# EAGLE design NOT (EAGLE 9.6.2)
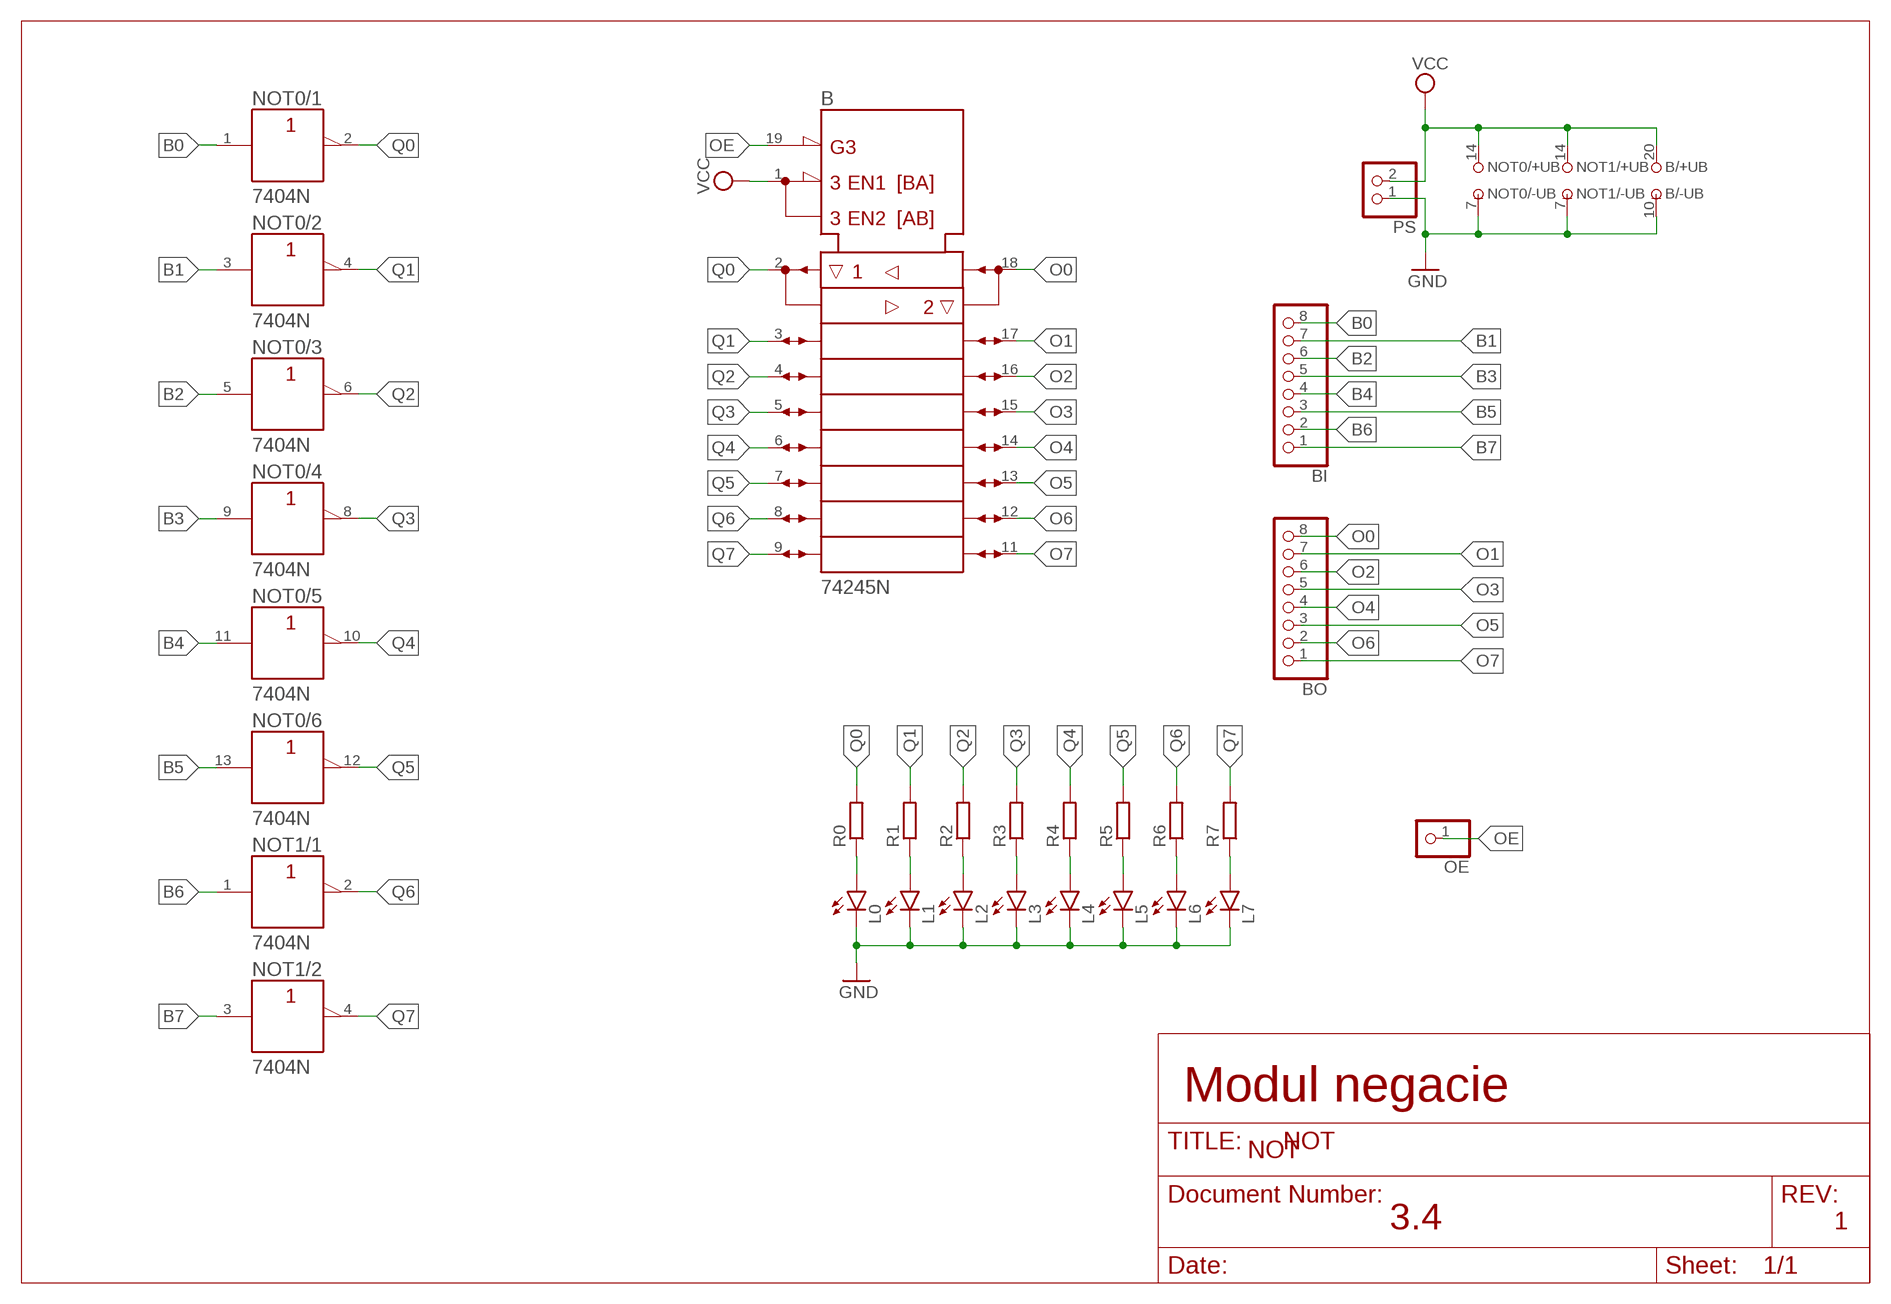
[diagram p0: schematic, sheet 1]

## Parts
B  74245N  [DIL20]
BI  PINHD-1X8  [1X08]
BO  PINHD-1X8  [1X08]
L0  LED5MM  [LED5MM]
L1  LED5MM  [LED5MM]
L2  LED5MM  [LED5MM]
L3  LED5MM  [LED5MM]
L4  LED5MM  [LED5MM]
L5  LED5MM  [LED5MM]
L6  LED5MM  [LED5MM]
L7  LED5MM  [LED5MM]
NOT0  7404N  [DIL14]
NOT1  7404N  [DIL14]
OE  PINHD-1X1  [1X01]
PS  PINHD-1X2  [1X02]
R0  R-EU_0204/7  [0204/7]
R1  R-EU_0204/7  [0204/7]
R2  R-EU_0204/7  [0204/7]
R3  R-EU_0204/7  [0204/7]
R4  R-EU_0204/7  [0204/7]
R5  R-EU_0204/7  [0204/7]
R6  R-EU_0204/7  [0204/7]
R7  R-EU_0204/7  [0204/7]

## Nets
B0: BI.8 NOT0.1(/1:A)
B1: BI.7 NOT0.3(/2:A)
B2: BI.6 NOT0.5(/3:A)
B3: BI.5 NOT0.9(/4:A)
B4: BI.4 NOT0.11(/5:A)
B5: BI.3 NOT0.13(/6:A)
B6: BI.2 NOT1.1(/1:A)
B7: BI.1 NOT1.3(/2:A)
GND: B.10(-UB) L0.K(C) L1.K(C) L2.K(C) L3.K(C) L4.K(C) L5.K(C) L6.K(C) L7.K(C) NOT0.7(/-UB:-UB) NOT1.7(/-UB:-UB) PS.1
N$33: L0.A R0.1
N$36: L1.A R1.1
N$39: L2.A R2.1
N$42: L3.A R3.1
N$45: L4.A R4.1
N$48: L5.A R5.1
N$51: L6.A R6.1
N$54: L7.A R7.1
O0: B.18(B1) BO.8
O1: B.17(B2) BO.7
O2: B.16(B3) BO.6
O3: B.15(B4) BO.5
O4: B.14(B5) BO.4
O5: B.13(B6) BO.3
O6: B.12(B7) BO.2
O7: B.11(B8) BO.1
OE: B.19(!G) OE.1
Q0: B.2(A1) NOT0.2(/1:Y) R0.2
Q1: B.3(A2) NOT0.4(/2:Y) R1.2
Q2: B.4(A3) NOT0.6(/3:Y) R2.2
Q3: B.5(A4) NOT0.8(/4:Y) R3.2
Q4: B.6(A5) NOT0.10(/5:Y) R4.2
Q5: B.7(A6) NOT0.12(/6:Y) R5.2
Q6: B.8(A7) NOT1.2(/1:Y) R6.2
Q7: B.9(A8) NOT1.4(/2:Y) R7.2
VCC: B.1(DIR) B.20(+UB) NOT0.14(/+UB:+UB) NOT1.14(/+UB:+UB) PS.2
Unconnected: NOT1.5(/3:A) NOT1.6(/3:Y) NOT1.8(/4:Y) NOT1.9(/4:A) NOT1.10(/5:Y) NOT1.11(/5:A) NOT1.12(/6:Y) NOT1.13(/6:A)

## Notes on the sheet
- Modul negacie
- NOT
- 3.4 | 1

## Library data of the parts
B = 74ttl-din:74*245: Octal BUS TRANSCEIVER, 3-state
BI BO = pinhead:PINHD-1X8: PIN HEADER
L0 L1-L7 = led:LED: LED OSRAM: - CHIPLED LG R971, LG N971, LY N971, LG Q971, LY Q971, LO R971, LY R971 LH N974, LH R974 LS Q976, LO Q976, LY Q976 LO Q996 - Hyper CHIPLED LW Q18S LB Q993, LB Q99A, LB R99A - SideLED LS A670, LO A670, LY A670, LG A670, LP A670 LB A673, LV A673, LT A673, LW A673 LH A674 LY A675 LS A676, LA A676, LO A676, LY A676, LW A676 LS A679, LY A679, LG A679 - Hyper Micro SIDELED® LS Y876, LA Y876, LO Y876, LY Y876 LT Y87S - SmartLED LW L88C, LW L88S LB L89C, LB L89S, LG L890 LS L89K, LO L89K, LY L89K LS L896, LA L896, LO L896, LY L896 - TOPLED LS T670, LO T670, LY T670, LG T670, LP T670 LSG T670, LSP T670, LSY T670, LOP T670, LYG T670 LG T671, LOG T671, LSG T671 LB T673, LV T673, LT T673, LW T673 LH T674 LS T676, LA T676, LO T676, LY T676, LB T676, LH T676, LSB T676, LW T676 LB T67C, LV T67C, LT T67C, LS T67K, LO T67K, LY T67K, LW E67C LS E67B, LA E67B, LO E67B, LY E67B, LB E67C, LV E67C, LT E67C LW T67C LS T679, LY T679, LG T679 LS T770, LO T770, LY T770, LG T770, LP T770 LB T773, LV T773, LT T773, LW T773 LH T774 LS E675, LA E675, LY E675, LS T675 LS T776, LA T776, LO T776, LY T776, LB T776 LHGB T686 LT T68C, LB T68C - Hyper Mini TOPLED® LB M676 - Mini TOPLED Santana® LG M470 LS M47K, LO M47K, LY M47K Source: http://www.osram.convergy.de LUXEON: - LUMILED® LXK2-PW12-R00, LXK2-PW12-S00, LXK2-PW14-U00, LXK2-PW14-V00 LXK2-PM12-R00, LXK2-PM12-S00, LXK2-PM14-U00 LXK2-PE12-Q00, LXK2-PE12-R00, LXK2-PE12-S00, LXK2-PE14-T00, LXK2-PE14-U00 LXK2-PB12-K00, LXK2-PB12-L00, LXK2-PB12-M00, LXK2-PB14-N00, LXK2-PB14-P00, LXK2-PB14-Q00 LXK2-PR12-L00, LXK2-PR12-M00, LXK2-PR14-Q00, LXK2-PR14-R00 LXK2-PD12-Q00, LXK2-PD12-R00, LXK2-PD12-S00 LXK2-PH12-R00, LXK2-PH12-S00 LXK2-PL12-P00, LXK2-PL12-Q00, LXK2-PL12-R00 Source: www.luxeon.com KINGBRIGHT: KA-3528ASYC Source: www.kingbright.com
NOT0 NOT1 = 74ttl-din:74*04: Hex INVERTER
OE = pinhead:PINHD-1X1: PIN HEADER
PS = pinhead:PINHD-1X2: PIN HEADER
R0 R1-R7 = rcl:R-EU_: RESISTOR, European symbol; SPICEPREFIX: R

## Board
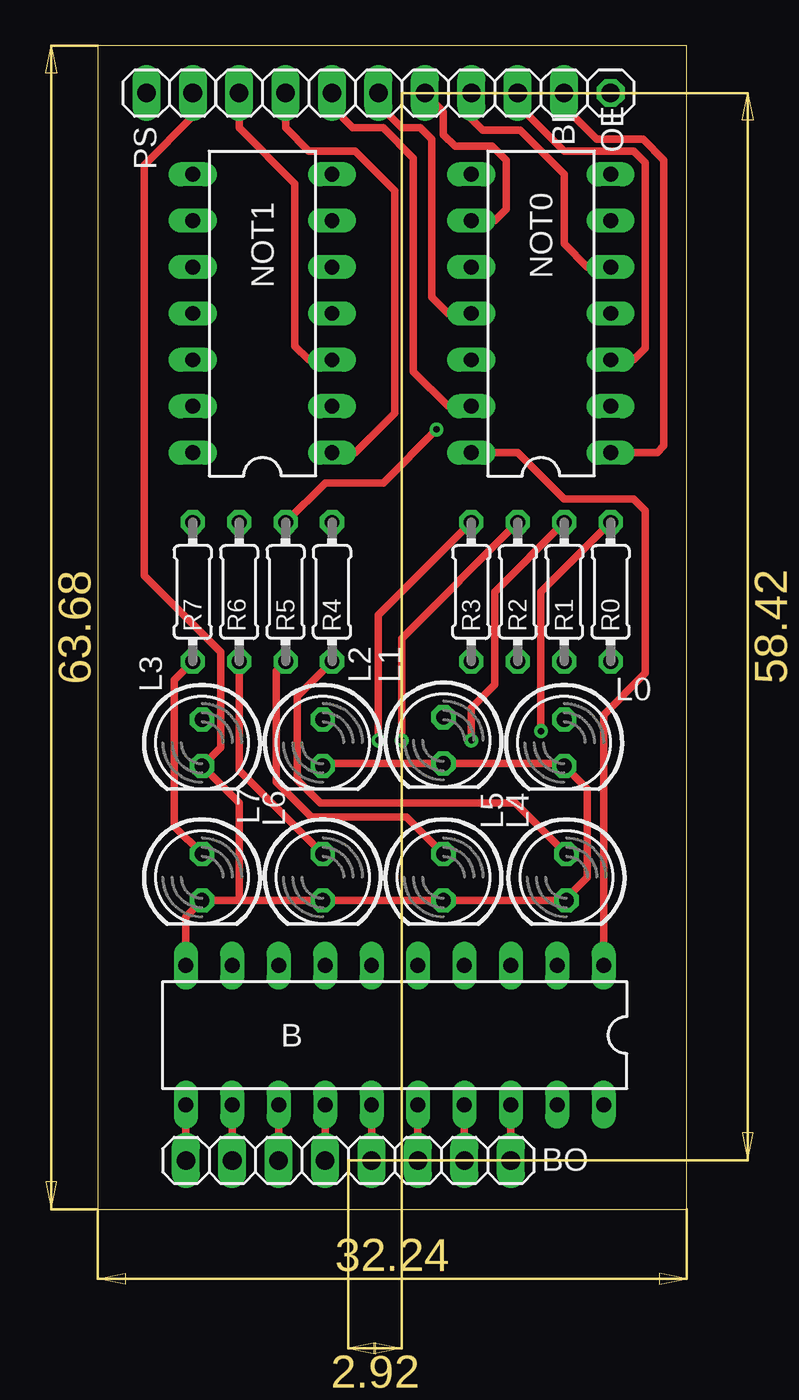
[diagram p1: board, top side]
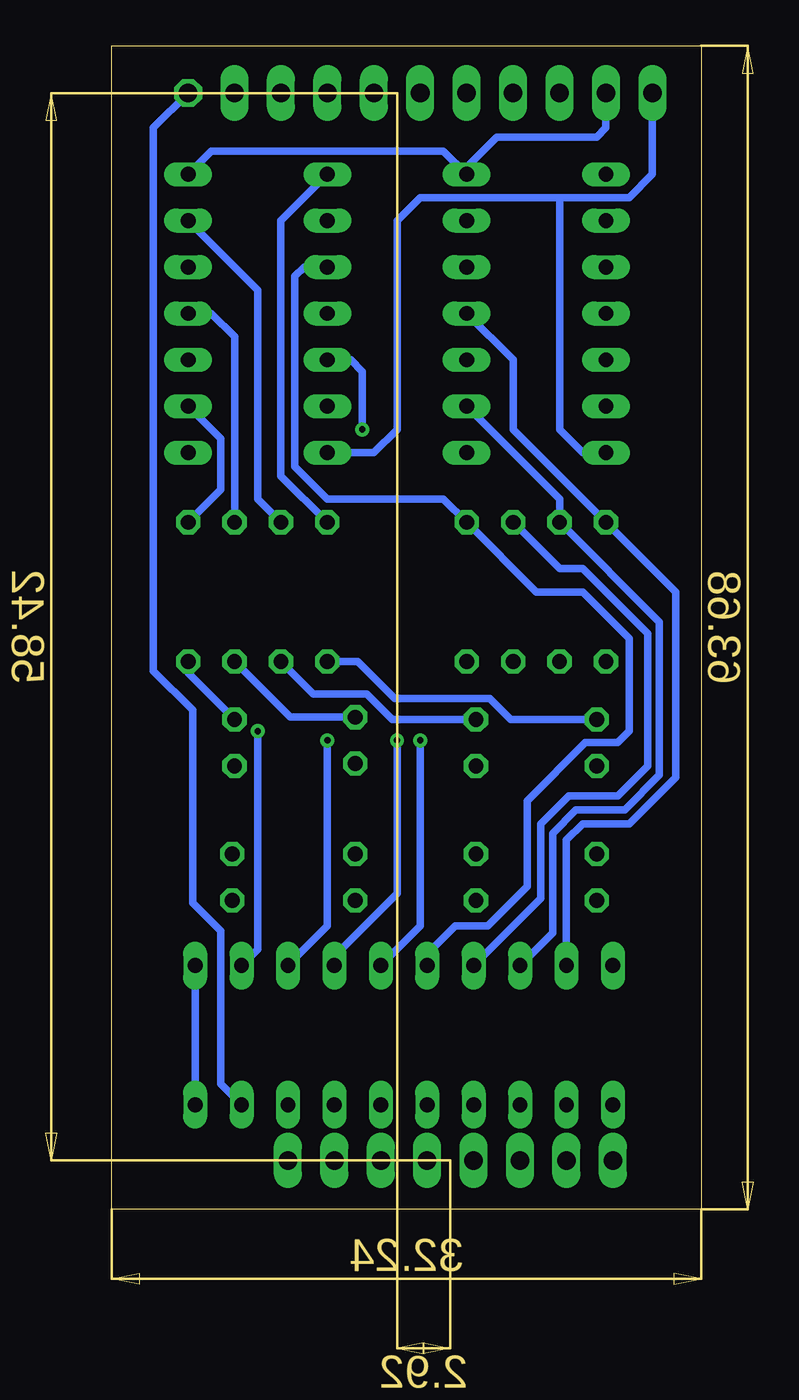
[diagram p2: board, bottom side, seen from below]

Size 32.24 x 63.68 mm. Coordinates in mm from the lower left corner, seen from the top.
Outline: 0,0 32.24,0 32.24,63.68 0,63.68 0,0
Copper layers (1*16): Top 0.035mm / dielectric 1.5mm / Bottom 0.035mm
Design rules "default": minimum track width 6mil, minimum drill 0.35mm, track to track 6mil, track to pad 6mil, pad to pad 6mil, via to via 6mil, smd to smd 6mil, copper to edge 40mil, drill to drill 6mil, minimum pad ring 10mil, minimum via ring 8mil, stop-mask expansion 4mil, vias tented up to drill 0mil, thermal gap 10mil

### Footprints (pad centres in the part's own frame; a part is rotated, then mirrored left to right if it is on the bottom)
DIL20 = drill 0.813 long: 1 -11.43,-3.81; 2 -8.89,-3.81; 3 -6.35,-3.81; 4 -3.81,-3.81; 5 -1.27,-3.81; 6 1.27,-3.81; 7 3.81,-3.81; 8 6.35,-3.81; 9 8.89,-3.81; 10 11.43,-3.81; 11 11.43,3.81; 12 8.89,3.81; 13 6.35,3.81; 14 3.81,3.81; 15 1.27,3.81; 16 -1.27,3.81; 17 -3.81,3.81; 18 -6.35,3.81; 19 -8.89,3.81; 20 -11.43,3.81
1X08 = drill 1.016 long: 1 -8.89,0; 2 -6.35,0; 3 -3.81,0; 4 -1.27,0; 5 1.27,0; 6 3.81,0; 7 6.35,0; 8 8.89,0
LED5MM = drill 0.813 octagon: A -1.27,0; K 1.27,0
DIL14 = drill 0.813 long: 1 -7.62,-3.81; 2 -5.08,-3.81; 3 -2.54,-3.81; 4 0,-3.81; 5 2.54,-3.81; 6 5.08,-3.81; 7 7.62,-3.81; 8 7.62,3.81; 9 5.08,3.81; 10 2.54,3.81; 11 0,3.81; 12 -2.54,3.81; 13 -5.08,3.81; 14 -7.62,3.81
1X01 = drill 1.016 octagon: 1 0,0
1X02 = drill 1.016 long: 1 -1.27,0; 2 1.27,0
0204/7 = drill 0.813 octagon: 1 -3.81,0; 2 3.81,0

### Placement (x,y rotation side)
B  16.26,9.53 180 top
BI  16.64,61.09 0 top
BO  13.72,2.67 0 top
L0  25.53,25.53 270 top
L1  18.92,25.65 270 top
L2  12.32,25.53 270 top
L3  5.71,25.53 270 top
L4  25.65,18.16 270 top
L5  18.92,18.16 270 top
L6  12.32,18.16 270 top
L7  5.71,18.16 270 top
NOT0  24.26,49.02 90 top
NOT1  9.02,49.02 90 top
OE  28.07,61.09 0 top
PS  3.94,61.09 180 top
R0  28.07,33.78 90 top
R1  25.53,33.78 90 top
R2  22.99,33.78 90 top
R3  20.45,33.78 90 top
R4  12.83,33.78 90 top
R5  10.29,33.78 90 top
R6  7.75,33.78 90 top
R7  5.21,33.78 90 top

### Tracks (layer width: path | path; a pad name or v marks a point on that pad's centre or on a via)
B0
  Top 0.4: NOT0.1 30.61,41.4 30.99,41.78 30.99,57.4 29.84,58.55 27.3,58.55 25.53,60.33 BI.8
B1
  Top 0.4: NOT0.3 29.34,46.48 29.97,47.12 29.97,57.28 29.34,57.91 25.53,57.91 22.99,60.45 BI.7
B2
  Top 0.4: NOT0.5 26.8,51.56 25.53,52.83 25.53,56.64 23.11,59.05 21.08,59.05 20.45,59.69 BI.6
B3
  Top 0.4: NOT0.9 21.72,54.1 22.35,54.74 22.35,57.4 21.59,58.17 19.56,58.17 18.92,58.8 18.92,60.07 BI.5
B4
  Top 0.4: NOT0.11 19.18,49.02 18.29,49.91 18.29,58.55 17.65,59.18 16.64,59.18 15.37,60.45 BI.4
B5
  Top 0.4: NOT0.13 19.18,43.94 17.27,45.85 17.27,57.53 15.62,59.18 13.97,59.18 12.83,60.33 BI.3
B6
  Top 0.4: NOT1.1 14.1,41.4 16.26,43.56 16.26,55.75 14.1,57.91 11.56,57.91 10.29,59.18 BI.2
B7
  Top 0.4: BI.1 7.75,59.18 10.79,56.13 10.79,47.24 11.56,46.48 NOT1.3
GND
  Top 0.4: 7.75,16.89 L7.K 4.83,16 B.10 | 7.75,16.89 L6.K L5.K 25.53,16.89 | 25.53,16.89 L4.K | 7.75,16.89 7.75,22.23 L3.K 6.73,25.27 6.73,30.48 2.54,34.67 2.54,57.15 5.21,59.82 PS.1 | L2.K 12.45,24.38 L1.K 25.4,24.38 L0.K 26.8,22.99 26.8,18.16 25.53,16.89
  Bottom 0.4: PS.1 5.21,59.18 5.71,58.67 11.18,58.67 12.83,57.02 NOT1.7 14.1,57.91 26.8,57.91 NOT0.7
N$33
  Bottom 0.4: L0.A 28.07,29.34 R0.1
N$36
  Bottom 0.4: L1.A 22.48,26.92 R1.1
N$39
  Bottom 0.4: L2.A 16.89,26.8 18.29,28.19 21.21,28.19 R2.1
N$42
  Bottom 0.4: L3.A 10.41,26.8 11.56,27.94 16.76,27.94 18.8,29.97 R3.1
N$45
  Top 0.4: R4.1 10.92,28.07 10.92,23.5 12.19,22.23 22.86,22.23 L4.A
N$48
  Top 0.4: L5.A 16.89,21.46 11.68,21.46 9.78,23.37 9.78,29.46 R5.1
N$51
  Top 0.4: L6.A 7.75,24 R6.1
N$54
  Top 0.4: L7.A 4.19,20.95 4.19,28.96 R7.1
O0
  Top 0.4: BO.8 B.18
O1
  Top 0.4: B.17 BO.7
O2
  Top 0.4: BO.6 B.16
O3
  Top 0.4: B.15 BO.5
O4
  Top 0.4: B.14 BO.4
O5
  Top 0.4: B.13 BO.3
O6
  Top 0.4: B.12 BO.2
O7
  Top 0.4: B.11 BO.1
OE
  Bottom 0.4: B.19 26.29,6.86 26.29,15.24 27.81,16.76 27.81,27.3 29.97,29.46 29.97,59.18 OE.1
Q0  (via drill 0.35)
  Top 0.4: R0.2 24.26,33.78 v24.26,26.16
  Bottom 0.4: R0.2 26.29,39.37 26.29,42.16 NOT0.2 | v24.26,26.16 24.26,14.22 B.2
Q1  (via drill 0.35)
  Top 0.4: v20.45,25.65 20.45,27.43 21.72,28.7 21.72,33.78 R1.2
  Bottom 0.4: NOT0.4 26.8,49.02 25.53,47.75 R1.2 | B.3 20.45,15.49 v20.45,25.65
Q2  (via drill 0.35)
  Top 0.4: R2.2 16.64,31.24 v16.64,25.65
  Bottom 0.4: R2.2 24.26,38.86 24.26,50.29 NOT0.6 | v16.64,25.65 16.64,17.27 20.07,13.84 B.4
Q3  (via drill 0.35)
  Top 0.4: v15.37,25.65 15.37,32.51 R3.2
  Bottom 0.4: NOT0.8 22.99,54.1 22.99,40.13 R3.2 | B.5 15.37,15.49 v15.37,25.65
Q4
  Bottom 0.4: NOT0.10 21.72,51.56 22.23,51.05 22.23,40.64 20.45,38.86 14.1,38.86 R4.2 9.02,33.78 6.48,33.78 3.94,31.24 3.94,26.16 4.57,25.53 6.35,25.53 9.53,22.35 9.53,17.65 11.68,15.49 13.46,15.49 14.99,13.97 B.6
Q5  (via drill 0.35)
  Top 0.4: R5.2 12.45,39.75 15.62,39.75 v18.54,42.67
  Bottom 0.4: v18.54,42.67 18.54,45.85 19.18,46.48 NOT0.12 | B.7 8.76,17.02 8.76,21.08 7.24,22.61 4.57,22.61 2.92,24.26 2.92,31.5 6.48,35.05 7.75,35.05 R5.2
Q6
  Bottom 0.4: NOT1.2 7.75,38.86 R6.2 2.29,32.13 2.29,23.75 4.19,21.84 6.86,21.84 8.13,20.57 8.13,15.11 B.8
Q7
  Bottom 0.4: NOT1.4 10.29,46.48 10.29,42.67 R7.2 1.4,33.78 1.4,23.62 3.94,21.08 6.48,21.08 7.37,20.19 B.9
VCC
  Top 0.4: NOT0.14 22.99,41.4 25.53,38.86 29.34,38.86 29.97,38.23 29.97,29.34 27.69,27.05 B.1
  Bottom 0.4: PS.2 2.67,56.64 3.94,55.37 7.75,55.37 | NOT0.14 17.91,41.4 16.64,42.67 16.64,54.1 15.37,55.37 7.75,55.37 | NOT1.14 6.48,41.4 7.75,42.67 7.75,55.37 | B.20 B.1